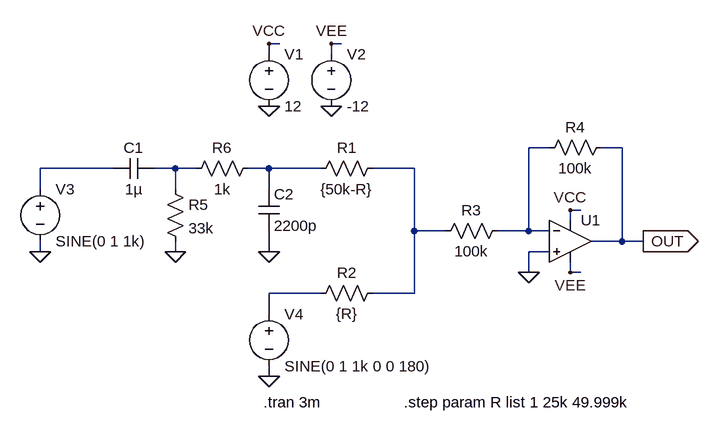
[diagram p0: schematic Dry_Wet_FV-1_Test_01.asc]
Dry_Wet_FV-1_Test_01.asc, the LTspice schematic file:
Version 4
SHEET 1 880 680
WIRE 0 -112 -16 -112
WIRE 96 -112 80 -112
WIRE -16 -96 -16 -112
WIRE 80 -96 80 -112
WIRE 416 48 384 48
WIRE 528 48 496 48
WIRE -256 80 -368 80
WIRE -160 80 -192 80
WIRE -128 80 -160 80
WIRE -16 80 -48 80
WIRE 64 80 -16 80
WIRE 208 80 144 80
WIRE -368 112 -368 80
WIRE -160 112 -160 80
WIRE -16 112 -16 80
WIRE 464 144 448 144
WIRE 448 160 448 144
WIRE 208 176 208 80
WIRE 256 176 208 176
WIRE 384 176 384 48
WIRE 384 176 336 176
WIRE 416 176 384 176
WIRE 528 192 528 48
WIRE 528 192 480 192
WIRE 560 192 528 192
WIRE -368 208 -368 192
WIRE -160 208 -160 192
WIRE -16 208 -16 176
WIRE 416 208 384 208
WIRE 384 240 384 208
WIRE 448 240 448 224
WIRE 464 240 448 240
WIRE 64 272 -16 272
WIRE 208 272 208 176
WIRE 208 272 144 272
WIRE -16 304 -16 272
WIRE -16 400 -16 384
FLAG 448 144 VCC
FLAG 448 240 VEE
FLAG 384 240 0
FLAG 560 192 OUT
IOPIN 560 192 Out
FLAG -16 -16 0
FLAG 80 -16 0
FLAG -16 -112 VCC
FLAG 80 -112 VEE
FLAG -368 208 0
FLAG -16 400 0
FLAG -160 208 0
FLAG -16 208 0
SYMBOL res 160 64 R90
WINDOW 0 0 56 VBottom 2
WINDOW 3 32 56 VTop 2
SYMATTR InstName R1
SYMATTR Value {50k-R}
SYMBOL res 160 256 R90
WINDOW 0 0 56 VBottom 2
WINDOW 3 32 56 VTop 2
SYMATTR InstName R2
SYMATTR Value {R}
SYMBOL res 352 160 R90
WINDOW 0 0 56 VBottom 2
WINDOW 3 32 56 VTop 2
SYMATTR InstName R3
SYMATTR Value 100k
SYMBOL Opamps\\UniversalOpamp2 448 192 R0
SYMATTR InstName U1
SYMBOL res 512 32 R90
WINDOW 0 0 56 VBottom 2
WINDOW 3 32 56 VTop 2
SYMATTR InstName R4
SYMATTR Value 100k
SYMBOL voltage -16 -112 R0
WINDOW 123 0 0 Left 0
WINDOW 39 0 0 Left 0
SYMATTR InstName V1
SYMATTR Value 12
SYMBOL voltage 80 -112 R0
WINDOW 123 0 0 Left 0
WINDOW 39 0 0 Left 0
SYMATTR InstName V2
SYMATTR Value -12
SYMBOL voltage -368 96 R0
WINDOW 123 0 0 Left 0
WINDOW 39 0 0 Left 0
SYMATTR InstName V3
SYMATTR Value SINE(0 1 1k)
SYMBOL voltage -16 288 R0
WINDOW 123 0 0 Left 0
WINDOW 39 0 0 Left 0
SYMATTR InstName V4
SYMATTR Value SINE(0 1 1k 0 0 180)
SYMBOL cap -192 64 R90
WINDOW 0 0 32 VBottom 2
WINDOW 3 32 32 VTop 2
SYMATTR InstName C1
SYMATTR Value 1µ
SYMBOL res -176 96 R0
SYMATTR InstName R5
SYMATTR Value 33k
SYMBOL res -32 64 R90
WINDOW 0 0 56 VBottom 2
WINDOW 3 32 56 VTop 2
SYMATTR InstName R6
SYMATTR Value 1k
SYMBOL cap -32 112 R0
SYMATTR InstName C2
SYMATTR Value 2200p
TEXT -24 440 Left 2 !.tran 3m
TEXT 192 440 Left 2 !.step param R list 1 25k 49.999k

The netlist it stands for:
* Dry_Wet_FV-1_Test_01.asc
R1 N005 N004 {50k-R}
R2 N005 N006 {R}
R3 N001 N005 100k
XU1 0 N001 VCC VEE OUT level.2 Avol=1Meg GBW=10Meg Slew=10Meg ilimit=25m rail=0 Vos=0 phimargin=45 en=0 enk=0 in=0 ink=0 Rin=500Meg  ; pins IN+ IN- V+ V- OUT
R4 OUT N001 100k
V1 VCC 0 12
V2 VEE 0 -12
V3 N002 0 SINE(0 1 1k)
V4 N006 0 SINE(0 1 1k 0 0 180)
C1 N003 N002 1µ
R5 N003 0 33k
R6 N004 N003 1k
C2 N004 0 2200p
.tran 3m
.step param R list 1 25k 49.999k
.lib UniversalOpamps2.sub
.backanno
.end